# Altium schematic sheet [7]_MOT_CONTROL LED STATUS.SchDoc
size A3; DocumentNumber: 7; SheetNumber: 7; SheetTotal: 12
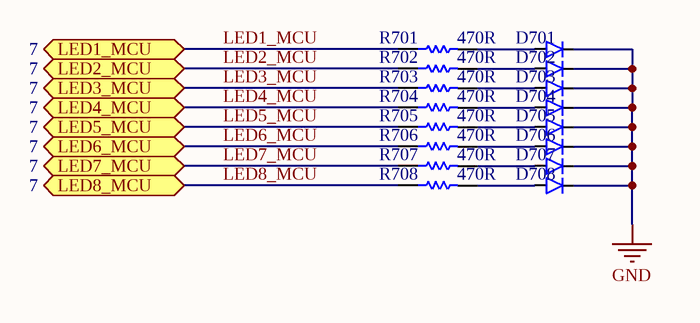
[diagram p0: [7]_MOT_CONTROL LED STATUS.SchDoc]

## Parts
D701  LED 0603  [LED0603]  (value not drawn)
D702  LED 0603  [LED0603]  (value not drawn)
D703  LED 0603  [LED0603]  (value not drawn)
D704  LED 0603  [LED0603]  (value not drawn)
D705  LED 0603  [LED0603]  (value not drawn)
D706  LED 0603  [LED0603]  (value not drawn)
D707  LED 0603  [LED0603]  (value not drawn)
D708  LED 0603  [LED0603]  (value not drawn)
R701  470R  [res 0603]
R702  470R  [res 0603]
R703  470R  [res 0603]
R704  470R  [res 0603]
R705  470R  [res 0603]
R706  470R  [res 0603]
R707  470R  [res 0603]
R708  470R  [res 0603]

## Ports
LED1_MCU (bidir, see 7), LED2_MCU (bidir, see 7), LED3_MCU (bidir, see 7), LED4_MCU (bidir, see 7), LED5_MCU (bidir, see 7), LED6_MCU (bidir, see 7), LED7_MCU (bidir, see 7), LED8_MCU (bidir, see 7)

## Nets
GND: D701.1(K) D702.1(K) D703.1(K) D704.1(K) D705.1(K) D706.1(K) D707.1(K) D708.1(K)
LED1_MCU: R701.1 ; port LED1_MCU
LED2_MCU: R702.1 ; port LED2_MCU
LED3_MCU: R703.1 ; port LED3_MCU
LED4_MCU: R704.1 ; port LED4_MCU
LED5_MCU: R705.1 ; port LED5_MCU
LED6_MCU: R706.1 ; port LED6_MCU
LED7_MCU: R707.1 ; port LED7_MCU
LED8_MCU: R708.1 ; port LED8_MCU
NetD701_2: D701.2(A) R701.2
NetD702_2: D702.2(A) R702.2
NetD703_2: D703.2(A) R703.2
NetD704_2: D704.2(A) R704.2
NetD705_2: D705.2(A) R705.2
NetD706_2: D706.2(A) R706.2
NetD707_2: D707.2(A) R707.2
NetD708_2: D708.2(A) R708.2

## Library data of the parts
R701-R708 = Res0.3: RES SMD, 470 OHM 5% 1/8W 0603; MANUFACTURER1: KOA Speer Electronics, Inc.; MANUFACTURER1_PART#: RK73B1JTTD471J; MANUFACTURER2_PART#: RMCF0603JT470R; PACKING: Tape & Reel (TR); PCB Footprint: 0603; Process Type: SM; Unit: PCS; Power: 0.25W; Value: 470R; CATEGORY: RES SMD; MANUFACTURER2: Stackpole; Tolerance: ±5%